# Altium schematic sheet Connectors.SchDoc
size A3
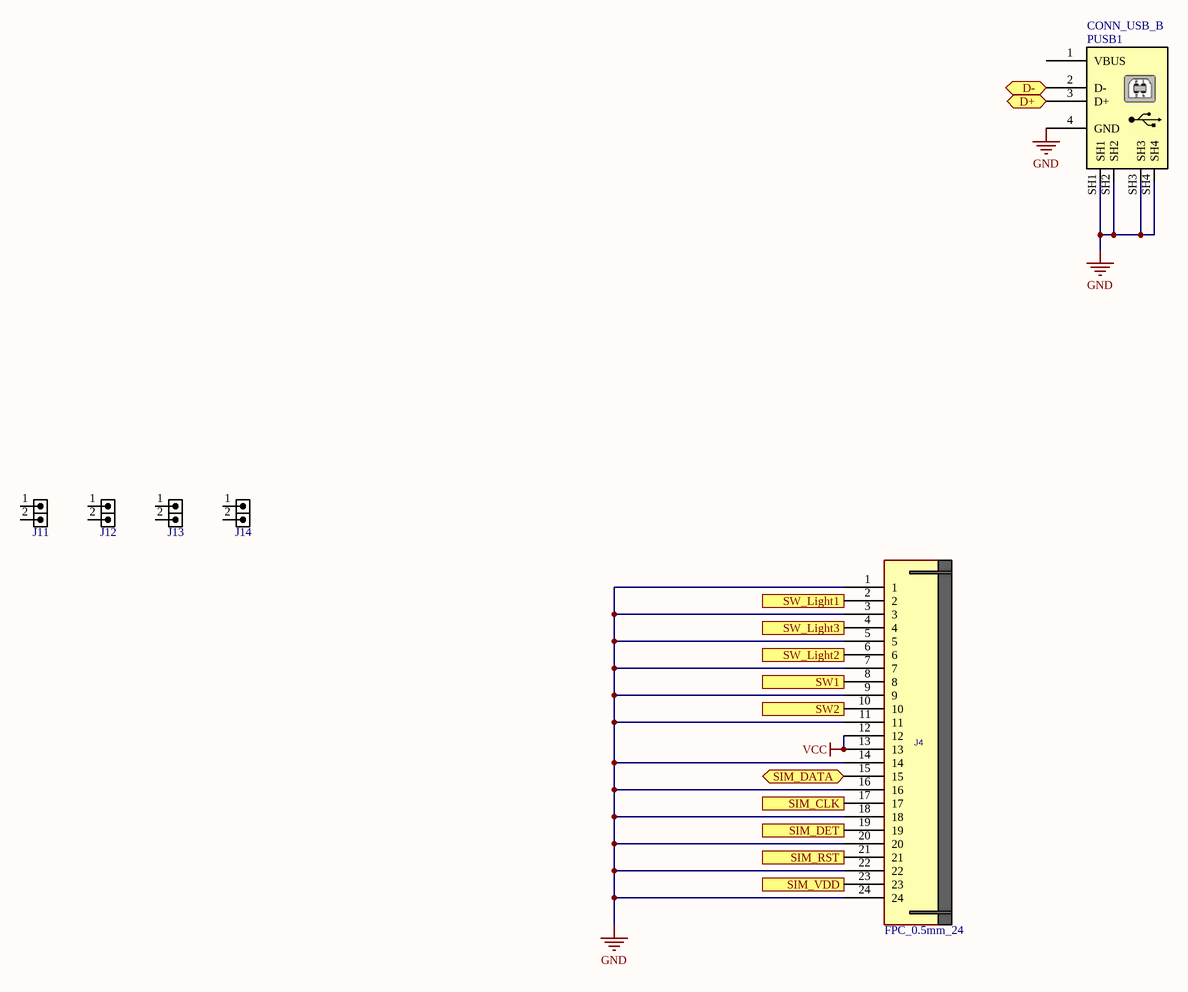
[diagram p0: Connectors.SchDoc]

## Parts
J4  FPC_0.5mm_24  [FPC50_24]
J11  HDRM2  [HDR_M_1X2]  (value not drawn)
J12  HDRM2  [HDR_M_1X2]  (value not drawn)
J13  HDRM2  [HDR_M_1X2]  (value not drawn)
J14  HDRM2  [HDR_M_1X2]  (value not drawn)
PUSB1  CONN_USB_B  [USB_B_ST]

## Ports
D+ (bidir), D- (bidir), SIM_CLK (in), SIM_DATA (bidir), SIM_DET (in), SIM_RST (in), SIM_VDD (in), SW1 (out), SW2 (out), SW_Light1 (in), SW_Light2 (in), SW_Light3 (in)

## Nets
GND: J4.1 J4.3 J4.5 J4.7 J4.9 J4.11 J4.14 J4.16 J4.18 J4.20 J4.22 J4.24 PUSB1.4(GND) PUSB1.SH1 PUSB1.SH2 PUSB1.SH3 PUSB1.SH4
VCC: J4.12 J4.13
D+: PUSB1.3(D+) ; port D+
D-: PUSB1.2(D-) ; port D-
SIM_CLK: J4.17 ; port SIM_CLK
SIM_DATA: J4.15 ; port SIM_DATA
SIM_DET: J4.19 ; port SIM_DET
SIM_RST: J4.21 ; port SIM_RST
SIM_VDD: J4.23 ; port SIM_VDD
SW1: J4.8 ; port SW1
SW2: J4.10 ; port SW2
SW_Light1: J4.2 ; port SW_Light1
SW_Light2: J4.6 ; port SW_Light2
SW_Light3: J4.4 ; port SW_Light3

Not connected (* = marked no-connect by the designer): J11 1 2; J12 1 2; J13 1 2; J14 1 2; PUSB1 1(VBUS)

## Library data of the parts
J4 = FPC50_24: CONN, FPC, 0.50mm pitch, RightAngle, Bot. Contact; DESC: FH12F-24S-0.5SH(55); MANF: MOLEX, Hirose, FCI; MANF_P#: 52437-2433, FH12-24S-0.5SH(55), SFV24R-1ST; VALUE: FPC_0.5mm_24
J11-J14 = HDR_M_1X2: CONN, HEADER, Male, pitch: 2.54mm, 2POS; VALUE: HDRM2
PUSB1 = USB_B_ST: CONN, USB, B, STRAIGHT, THD; MANF_P#: -; MANF: -; VALUE: CONN_USB_B